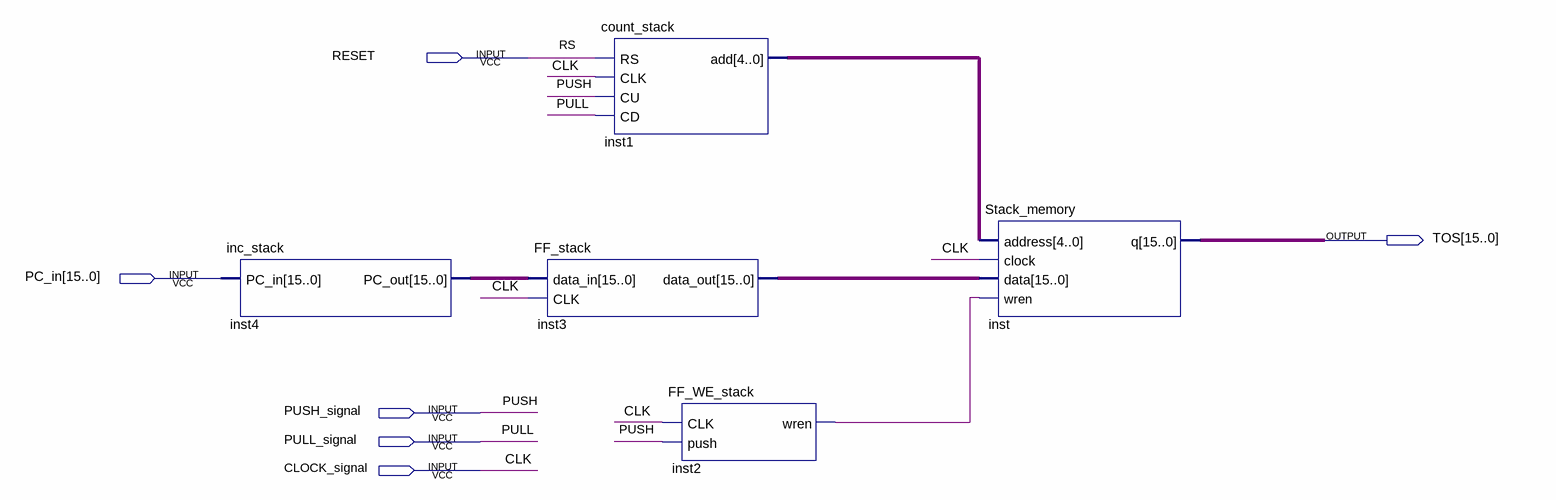
[diagram p0: schematic sheet]
// Quartus schematic StackBlock.bdf as structural Verilog: 5 symbols, 6 pins
module StackBlock (
  input  RESET,
  input  [15:0] PC_in,
  input  PUSH_signal,
  input  PULL_signal,
  input  CLOCK_signal,
  output [15:0] TOS
);

  wire inst2_wren;
  wire [4:0] inst1_add;
  wire [15:0] inst3_data_out, inst4_pc_out;

  inc_stack inst4 (.PC_in(PC_in), .PC_out(inst4_pc_out));
  count_stack inst1 (.RS(RESET), .CLK(CLOCK_signal), .CU(PUSH_signal), .CD(PULL_signal), .add(inst1_add));
  FF_stack inst3 (.data_in(inst4_pc_out), .CLK(CLOCK_signal), .data_out(inst3_data_out));
  FF_WE_stack inst2 (.CLK(CLOCK_signal), .push(PUSH_signal), .wren(inst2_wren));
  Stack_memory inst (.address(inst1_add), .clock(CLOCK_signal), .data(inst3_data_out), .wren(inst2_wren), .q(TOS));

  // Other names for the same wires on the sheet: CLK = CLOCK_signal; PULL = PULL_signal; PUSH = PUSH_signal;
  //   RS = RESET
endmodule
